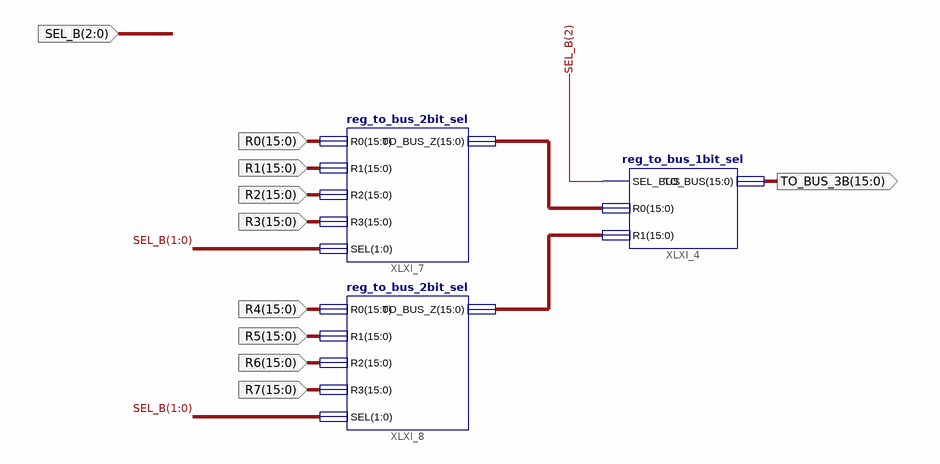
[diagram p0: schematic sheet 1]
// Xilinx ISE schematic reg_to_bus_3bit_sel.sch (artix7) as structural Verilog: 3 symbols, 10 ports
module reg_to_bus_3bit_sel (
  input  [15:0] R0,
  input  [15:0] R1,
  input  [15:0] R2,
  input  [15:0] R3,
  input  [15:0] R4,
  input  [15:0] R5,
  input  [15:0] R6,
  input  [15:0] R7,
  input  [2:0] SEL_B,
  output [15:0] TO_BUS_3B
);

  wire [15:0] XLXN_1, XLXN_2;

  reg_to_bus_1bit_sel XLXI_4 (.SEL_BUS(SEL_B[2]), .R0(XLXN_1), .R1(XLXN_2), .TO_BUS(TO_BUS_3B));
  reg_to_bus_2bit_sel XLXI_7 (.R1(R1), .R0(R0), .R2(R2), .R3(R3), .SEL(SEL_B[1:0]), .TO_BUS_Z(XLXN_1));
  reg_to_bus_2bit_sel XLXI_8 (.R1(R5), .R0(R4), .R2(R6), .R3(R7), .SEL(SEL_B[1:0]), .TO_BUS_Z(XLXN_2));
endmodule
